# Altium schematic sheet 06 SDIO WIFI&BT.SchDoc
size 420 x 297 mm
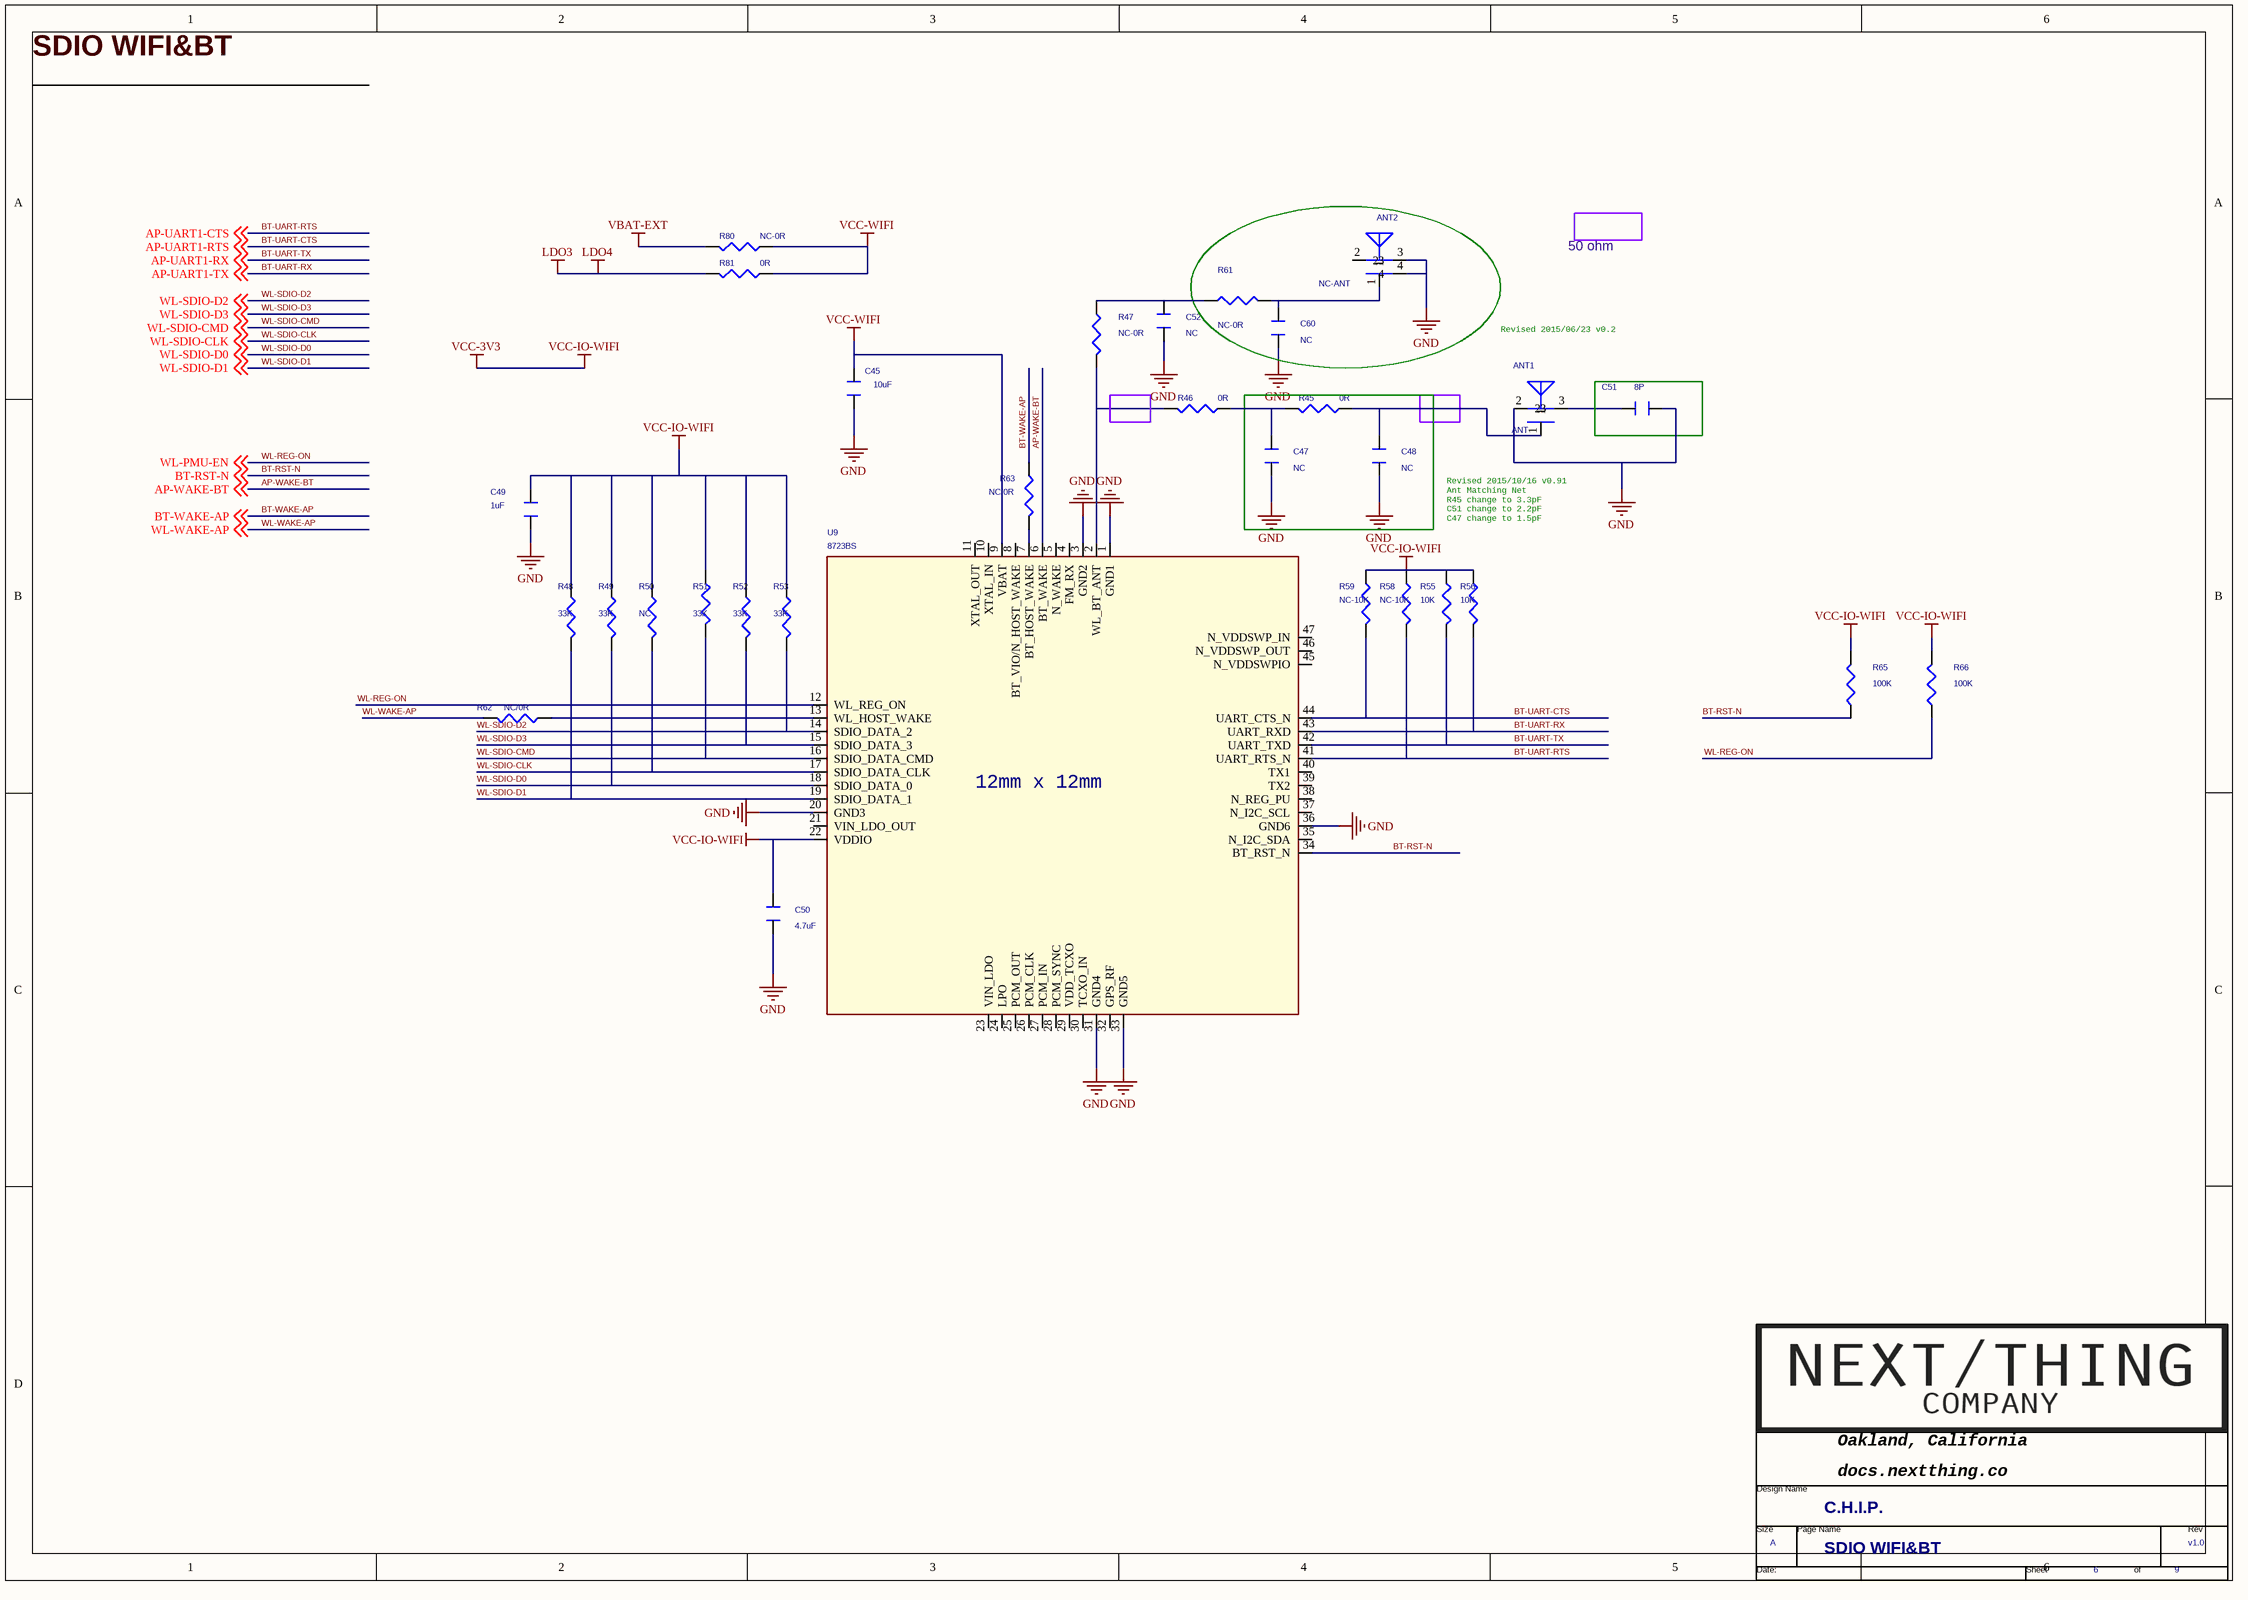
[diagram p0: 06 SDIO WIFI&BT.SchDoc]

## Parts
*  Page Count: 9  Page Number: 6  Page Size: A  Title: C.H.I.P.  RevCode: v1.0  Doc: SDIO WIFI&BT  (hidden comment: TitleBlock1-nextthing)  (graphical)
ANT1  ANT  [WIFI-1206]
ANT2  NC-ANT  [WIFI-ANT-SD73412-011H1_3A]
C45  10uF  [CC0603]
C47  NC  [C0201]
C48  NC  [C0201]
C49  1uF  [CC0402]
C50  4.7uF  [CC0603]
C51  8P  [C0201]
C52  NC  [C0201]
C60  NC  [C0201]
R45  0R  [C0201]
R46  0R  [C0201]
R47  NC-0R  [C0201]
R48  33K  [C0201]
R49  33K  [C0201]
R50  NC  [C0201]
R51  33K  [C0201]
R52  33K  [C0201]
R53  33K  [C0201]
R55  10K  [C0201]
R56  10K  [C0201]
R58  NC-10K  [C0201]
R59  NC-10K  [C0201]
R61  NC-0R  [C0201]
R62  NC/0R  [C0201]
R63  NC/0R  [C0201]
R65  100K  [C0201]
R66  100K  [C0201]
R80  NC-0R  [R0805]
R81  0R  [R0805]
U9  8723BS  [QFN44-AP6476-12X12H1_6A]

## Nets
GND: ANT1.2 ANT2.3 ANT2.4 C45.1 C47.2 C48.2 C49.1 C50.2 C51.2 C52.2 C60.2 U9.1(GND1) U9.3(GND2) U9.20(GND3) U9.31(GND4) U9.33(GND5) U9.36(GND6)
LDO3: R81.2  [also labelled LDO4]
VBAT-EXT: R80.2
VCC-3V3: C49.2 C50.1 R48.1 R49.1 R50.1 R51.1 R52.1 R53.1 R55.1 R56.1 R58.1 R59.1 R65.2 R66.2 U9.22(VDDIO)  [also labelled VCC-IO-WIFI]
VCC-WIFI: C45.2 R80.1 R81.1 U9.9(VBAT)
AP-WAKE-BT: U9.6(BT_WAKE) ; off-sheet AP-WAKE-BT
BT-RST-N: R65.1 U9.34(BT_RST_N) ; off-sheet BT-RST-N
BT-UART-CTS: R59.2 U9.44(UART_CTS_N) ; off-sheet AP-UART1-RTS  [also labelled AP-UART1-RTS]
BT-UART-RTS: R58.2 U9.41(UART_RTS_N) ; off-sheet AP-UART1-CTS  [also labelled AP-UART1-CTS]
BT-UART-RX: R56.2 U9.43(UART_RXD) ; off-sheet AP-UART1-TX  [also labelled AP-UART1-TX]
BT-UART-TX: R55.2 U9.42(UART_TXD) ; off-sheet AP-UART1-RX  [also labelled AP-UART1-RX]
BT-WAKE-AP: R63.2 ; off-sheet BT-WAKE-AP
WL-REG-ON: R66.1 U9.12(WL_REG_ON) ; off-sheet WL-PMU-EN  [also labelled WL-PMU-EN]
WL-SDIO-CLK: R50.2 U9.17(SDIO_DATA_CLK) ; off-sheet WL-SDIO-CLK
WL-SDIO-CMD: R51.2 U9.16(SDIO_DATA_CMD) ; off-sheet WL-SDIO-CMD
WL-SDIO-D0: R49.2 U9.18(SDIO_DATA_0) ; off-sheet WL-SDIO-D0
WL-SDIO-D1: R48.2 U9.19(SDIO_DATA_1) ; off-sheet WL-SDIO-D1
WL-SDIO-D2: R53.2 U9.14(SDIO_DATA_2) ; off-sheet WL-SDIO-D2
WL-SDIO-D3: R52.2 U9.15(SDIO_DATA_3) ; off-sheet WL-SDIO-D3
WL-WAKE-AP: R62.2 ; off-sheet WL-WAKE-AP
NetANT1_1: ANT1.1 C48.1 R45.1
NetANT1_3: ANT1.3 C51.1
NetANT2_1: ANT2.1 C60.1 R61.2
NetC47_1: C47.1 R45.2 R46.1
NetC52_1: C52.1 R47.1 R61.1
NetR46_2: R46.2 R47.2 U9.2(WL_BT_ANT)
NetR62_1: R62.1 U9.13(WL_HOST_WAKE)
NetR63_1: R63.1 U9.7(BT_HOST_WAKE)

Not connected (* = marked no-connect by the designer): ANT2 2; U9 4(FM_RX) 5(N_WAKE) 8(BT_VIO/N_HOST_WAKE) 10(XTAL_IN) 11(XTAL_OUT) 21(VIN_LDO_OUT) 23(VIN_LDO) 24(LPO) 25(PCM_OUT) 26(PCM_CLK) 27(PCM_IN) 28(PCM_SYNC) 29(VDD_TCXO) 30(TCXO_IN) 32(GPS_RF) 35(N_I2C_SDA) 37(N_I2C_SCL) 38(N_REG_PU) 39(TX2) 40(TX1) 45(N_VDDSWPIO) 46(N_VDDSWP_OUT) 47(N_VDDSWP_IN)

## Notes on the sheet
- SDIO WIFI&BT
- 50 ohm
- Revised 2015/06/23 v0.2
- Revised 2015/10/16 v0.91
  Ant Matching Net
  R45 change to 3.3pF
  C51 change to 2.2pF
  C47 change to 1.5pF
- (in symbol AP6493_4) 12mm x 12mm
- (in symbol TitleBlock1-nextthing) Oakland, California; Design Name; docs.nextthing.co /; Size; Page Name; Rev; Date:; Sheet; of

## Library data of the parts
ANT1 = ANT_2
ANT2 = ANT_4
C45 C47-C52 C60 = CAPACITOR_0_Dup4: PAGE: 2
R45-R53 R55 R56 R58 R59 R61-R63 R65 R66 R80 R81 = R_Dup1
U9 = AP6493_4: Device: AMPAK_SIP; QVL: AMPAK; ORCAD_LIB: MODULE
* = TitleBlock1-nextthing: Page Create Date: March  8, 1995